# EAGLE design ChestStrapV3 (EAGLE 5.07)
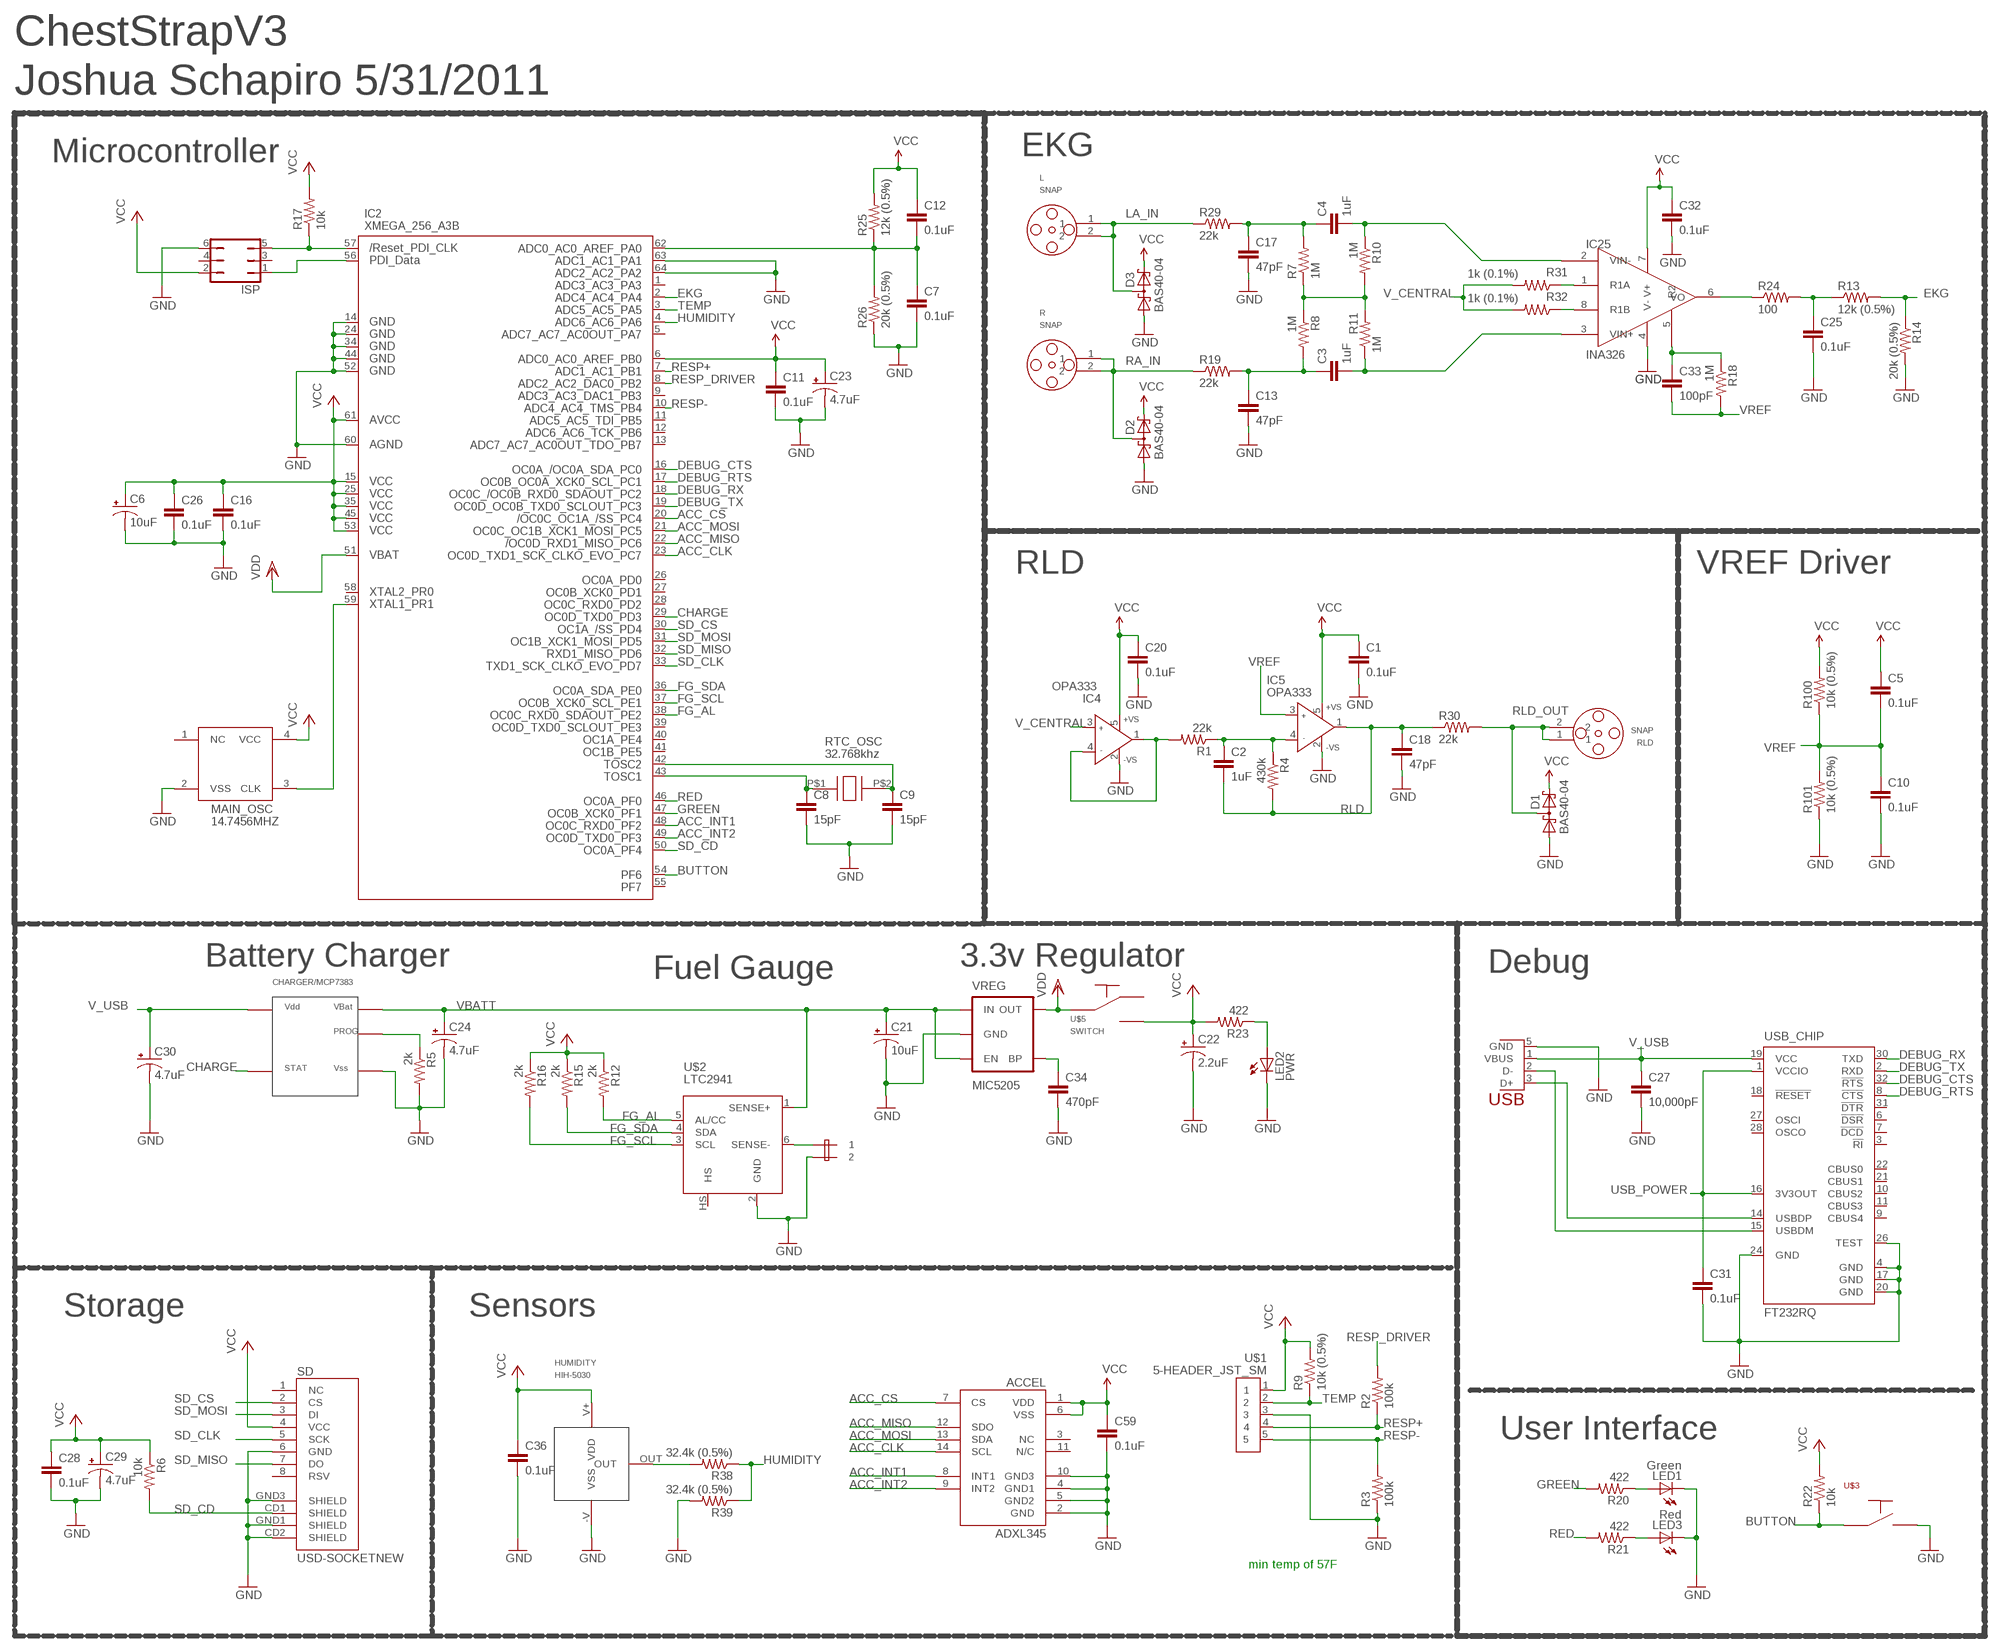
[diagram p0: schematic, sheet 1]

## Parts
ACCEL  ADXL345  [LGA14]
C1  0.1uF  CAP0805  [0805]
C2  1uF  CAP0805  [0805]
C3  1uF  CAP0805  [0805]
C4  1uF  CAP0805  [0805]
C5  0.1uF  CAP0805  [0805]
C6  10uF  CAP_POL1206  [EIA3216]
C7  0.1uF  CAP0805  [0805]
C8  15pF  CAP0805  [0805]
C9  15pF  CAP0805  [0805]
C10  0.1uF  CAP0805  [0805]
C11  0.1uF  CAP0805  [0805]
C12  0.1uF  CAP0805  [0805]
C13  47pF  CAP0805  [0805]
C16  0.1uF  CAP0805  [0805]
C17  47pF  CAP0805  [0805]
C18  47pF  CAP0805  [0805]
C20  0.1uF  CAP0805  [0805]
C21  10uF  CAP_POL1206  [EIA3216]
C22  2.2uF  CAP_POL1206  [EIA3216]
C23  4.7uF  CAP_POL1206  [EIA3216]
C24  4.7uF  CAP_POL1206  [EIA3216]
C25  0.1uF  CAP0805  [0805]
C26  0.1uF  CAP0805  [0805]
C27  10,000pF  CAP0805  [0805]
C28  0.1uF  CAP0805  [0805]
C29  4.7uF  CAP_POL1206  [EIA3216]
C30  4.7uF  CAP_POL1206  [EIA3216]
C31  0.1uF  CAP0805  [0805]
C32  0.1uF  CAP0805  [0805]
C33  100pF  CAP0805  [0805]
C34  470pF  CAP0805  [0805]
C36  0.1uF  CAP0805  [0805]
C59  0.1uF  CAP0805  [0805]
CHARGER/MCP7383  MCP73831  [SOT23-5]
D1  BAS40-04  [SOT23]
D2  BAS40-04  [SOT23]
D3  BAS40-04  [SOT23]
HUMIDITY  HIH-5030  [HIH-5030]
IC2  XMEGA_256_A3B  AVR_XMEGA_A3B_64M2  [MLF64]
IC4  OPA333  AD8067  [SOT23-5]
IC5  OPA333  AD8067  [SOT23-5]
IC25  INA326  [DGK_S-PDSO-G8]
ISP  JP3Q  [JP3Q]
L  SNAP  [SNAP]
LED1  Green  LEDCHIP-LED0805  [CHIP-LED0805]
LED2  PWR  LEDCHIP-LED0805  [CHIP-LED0805]
LED3  Red  LEDCHIP-LED0805  [CHIP-LED0805]
MAIN_OSC  14.7456MHZ  16MHZ-OSC  [4-SMD]
R  SNAP  [SNAP]
R1  22k  RESISTOR0805-RES  [0805]
R2  100k  RESISTOR0805-RES  [0805]
R3  100k  RESISTOR0805-RES  [0805]
R4  430k  RESISTOR0805-RES  [0805]
R5  2k  RESISTOR0805-RES  [0805]
R6  10k  RESISTOR0805-RES  [0805]
R7  1M  RESISTOR0805-RES  [0805]
R8  1M  RESISTOR0805-RES  [0805]
R9  10k (0.5%)  RESISTOR0805-RES  [0805]
R10  1M  RESISTOR0805-RES  [0805]
R11  1M  RESISTOR0805-RES  [0805]
R12  2k  RESISTOR0805-RES  [0805]
R13  12k (0.5%)  RESISTOR0805-RES  [0805]
R14  20k (0.5%)  RESISTOR0805-RES  [0805]
R15  2k  RESISTOR0805-RES  [0805]
R16  2k  RESISTOR0805-RES  [0805]
R17  10k  RESISTOR0805-RES  [0805]
R18  1M  RESISTOR0805-RES  [0805]
R19  22k  RESISTOR0805-RES  [0805]
R20  422  RESISTOR0805-RES  [0805]
R21  422  RESISTOR0805-RES  [0805]
R22  10k  RESISTOR0805-RES  [0805]
R23  422  RESISTOR0805-RES  [0805]
R24  100  RESISTOR0805-RES  [0805]
R25  12k (0.5%)  RESISTOR0805-RES  [0805]
R26  20k (0.5%)  RESISTOR0805-RES  [0805]
R29  22k  RESISTOR0805-RES  [0805]
R30  22k  RESISTOR0805-RES  [0805]
R31  1k (0.1%)  RESISTOR0805-RES  [0805]
R32  1k (0.1%)  RESISTOR0805-RES  [0805]
R38  32.4k (0.5%)  RESISTOR0805-RES  [0805]
R39  32.4k (0.5%)  RESISTOR0805-RES  [0805]
R100  10k (0.5%)  RESISTOR0805-RES  [0805]
R101  10k (0.5%)  RESISTOR0805-RES  [0805]
RLD  SNAP  [SNAP]
RTC_OSC  32.768khz  RTC_CRYSTAL  [2-SMD]
SD  USD-SOCKETNEW  [MICRO-SD-SOCKET-PP]
U$1  5-HEADER_JST_SM  [5-HEADER_JST_SM]
U$2  LTC2941  [6-LEAD_DFN]
U$3  BUTTON  [SMDBUTTON]
U$4  2_HEADER_W/SR  [2-HEADER_W/SR]
U$5  SWITCH  [RA_J7_SM_SWTICH]
U$6  MICROB_SM  [MICROB_USB_SM]
USB_CHIP  FT232RQ  [QFN32]
VREG  MIC5205  V_REG_LDOSMD  [SOT23-5]

## Nets
ACC_CLK: ACCEL.14(SCL) IC2.23(PC7)
ACC_CS: ACCEL.7(CS) IC2.20(PC4)
ACC_INT1: ACCEL.8(INT1) IC2.48(PF2)
ACC_INT2: ACCEL.9(INT2) IC2.49(PF3)
ACC_MISO: ACCEL.12(SDO) IC2.22(PC6)
ACC_MOSI: ACCEL.13(SDA) IC2.21(PC5)
BUTTON: IC2.54(PF6) R22.1 U$3.1
CHARGE: CHARGER/MCP7383.1 IC2.29(PD3)
D+: U$6.3(D+) USB_CHIP.14(USBDP)
D-: U$6.2(D-) USB_CHIP.15(USBDM)
DEBUG_CTS: IC2.16(PC0) USB_CHIP.32(!RTS)
DEBUG_RTS: IC2.17(PC1) USB_CHIP.8(!CTS)
DEBUG_RX: IC2.18(PC2) USB_CHIP.30(TXD)
DEBUG_TX: IC2.19(PC3) USB_CHIP.2(RXD)
EKG: IC2.2(PA4) R13.2 R14.1
FG_AL: IC2.38(PE2) R12.2 U$2.5(AL/CC)
FG_SCL: IC2.37(PE1) R16.2 U$2.3(SCL)
FG_SDA: IC2.36(PE0) R15.2 U$2.4(SDA)
GND: ACCEL.2(GND) ACCEL.4(GND1) ACCEL.5(GND2) ACCEL.10(GND3) C1.2 C6.C(-) C7.2 C8.2 C9.2 C10.2 C11.2 C13.2 C16.2 C17.2 C18.2 C20.2 C21.C(-) C22.C(-) C23.C(-) C24.C(-) C25.2 C26.2 C27.2 C28.2 C29.C(-) C30.C(-) C31.2 C32.2 C34.2 C36.2 C59.2 CHARGER/MCP7383.2 D1.1(A1) D2.1(A1) D3.1(A1) HUMIDITY.-V(VSS) IC2.14(GND1) IC2.24(GND2) IC2.34(GND3) IC2.44(GND4) IC2.52(GND5) IC2.60(AGND) IC2.63(PA1) IC2.64(PA2) IC4.2(-VS) IC5.2(-VS) IC25.4(V-) ISP.6 LED1.C LED2.C LED3.C MAIN_OSC.2(VSS) R3.1 R5.2 R14.2 R26.1 R39.2 R101.1 SD.6(GND) SD.CD2(SHIELD) SD.GND1(SHIELD) SD.GND3(SHIELD) U$1.3 U$2.2(GND) U$3.3 U$4.2 U$6.5(GND) USB_CHIP.4(GND) USB_CHIP.17(GND) USB_CHIP.20(GND) USB_CHIP.24(GND) USB_CHIP.26(TEST) VREG.2(GND)
GREEN: IC2.47(PF1) R20.2
HUMIDITY: IC2.4(PA6) R38.1 R39.1
LA: C4.2 IC25.2(VIN-) R10.1
LA_IN: D3.3(C1A2) L.1 L.2 R29.1
N$1: C25.1 R13.1 R24.2
N$2: IC25.6(VO) R24.1
N$3: C34.1 VREG.4(BP)
N$4: C9.1 IC2.42(TOSC2) RTC_OSC.P$2
N$5: LED3.A R21.1
N$6: IC2.57(RESET) ISP.5 R17.1
N$7: IC2.56(PDI_DATA) ISP.1
N$8: C8.1 IC2.43(TOSC1) RTC_OSC.P$1
N$9: IC2.59(PR1) MAIN_OSC.3(CLK)
N$10: LED1.A R20.1
N$11: C7.1 C12.2 IC2.62(PA0) R25.1 R26.2
N$14: C3.1 C13.1 R8.2 R19.2
N$15: U$2.6(SENSE-) U$4.1
N$16: CHARGER/MCP7383.5 R5.1
N$18: IC25.1(R1A) R31.1
N$23: LED2.A R23.1
N$26: R7.1 R8.1 R10.2 R11.2
N$28: IC4.1(OUT) IC4.4(IN-) R1.2
N$32: C4.1 C17.1 R7.2 R29.2
N$36: IC25.8(R1B) R32.1
N$37: C33.1 IC25.5(R2) R18.1
N$38: C2.1 IC5.4(IN-) R1.1 R4.1
N$58: HUMIDITY.OUT R38.2
RA: C3.2 IC25.3(VIN+) R11.1
RA_IN: D2.3(C1A2) R19.1 R.1 R.2
RED: IC2.46(PF0) R21.2
RESP+: IC2.7(PB1) R2.1 U$1.4
RESP-: IC2.10(PB4) R3.2 U$1.5
RESP_DRIVER: IC2.8(PB2) R2.2
RLD: C2.2 C18.1 IC5.1(OUT) R4.2 R30.1
RLD_OUT: D1.3(C1A2) R30.2 RLD.1 RLD.2
SD_CD: IC2.50(PF4) R6.2 SD.CD1(SHIELD)
SD_CLK: IC2.33(PD7) SD.5(SCK)
SD_CS: IC2.30(PD4) SD.2(CS)
SD_MISO: IC2.32(PD6) SD.7(DO)
SD_MOSI: IC2.31(PD5) SD.3(DI)
TEMP: IC2.3(PA5) R9.1 U$1.2
USB_POWER: C31.1 USB_CHIP.1(VCCIO) USB_CHIP.16(3V3OUT)
V_CENTRAL: IC4.3(IN+) R31.2 R32.2
V_USB: C27.1 C30.A(+) CHARGER/MCP7383.4 U$6.1(VBUS) USB_CHIP.19(VCC)
VBATT: C21.A(+) C24.A(+) CHARGER/MCP7383.3 U$2.1(SENSE+) VREG.1(IN) VREG.3(EN)
VCC: ACCEL.1(VDD) ACCEL.6(VSS) C1.1 C5.1 C6.A(+) C11.1 C12.1 C16.1 C20.1 C22.A(+) C23.A(+) C26.1 C28.1 C29.A(+) C32.1 C36.1 C59.1 D1.2(C2) D2.2(C2) D3.2(C2) HUMIDITY.V+(VDD) IC2.6(PB0) IC2.15(VCC1) IC2.25(VCC2) IC2.35(VCC3) IC2.45(VCC4) IC2.53(VCC5) IC2.61(AVCC) IC4.5(+VS) IC5.5(+VS) IC25.7(V+) ISP.2 MAIN_OSC.4(VCC) R6.1 R9.2 R12.1 R15.1 R16.1 R17.2 R22.2 R23.2 R25.2 R100.2 SD.4(VCC) U$1.1 U$5.3
VDD: IC2.51(VBAT) U$5.2 VREG.5(OUT)
VREF: C5.2 C10.1 C33.2 IC5.3(IN+) R18.2 R100.1 R101.2
Unconnected: ACCEL.3(NC) ACCEL.11(N/C) IC2.1(PA3) IC2.5(PA7) IC2.9(PB3) IC2.11(PB5) IC2.12(PB6) IC2.13(PB7) IC2.26(PD0) IC2.27(PD1) IC2.28(PD2) IC2.39(PE3) IC2.40(PE4) IC2.41(PE5) IC2.55(PF7) IC2.58(PR0) ISP.3 ISP.4 MAIN_OSC.1(NC) SD.1(NC) SD.8(RSV) U$2.HS U$5.1 USB_CHIP.3(!RI) USB_CHIP.6(!DSR) USB_CHIP.7(!DCD) USB_CHIP.9(CBUS4) USB_CHIP.10(CBUS2) USB_CHIP.11(CBUS3) USB_CHIP.18(!RESET) USB_CHIP.21(CBUS1) USB_CHIP.22(CBUS0) USB_CHIP.27(OSCI) USB_CHIP.28(OSCO) USB_CHIP.31(!DTR)

## Notes on the sheet
- ChestStrapV3
- Joshua Schapiro 5/31/2011
- Microcontroller | EKG
- RLD | VREF Driver
- Battery Charger | 3.3v Regulator | Debug
- Fuel Gauge
- Storage | Sensors
- User Interface
- min temp of 57F

## Library data of the parts
ACCEL = SparkFun:ADXL345
C1-C5 C7-C13 C16-C18 C20 C25-C28 C31-C34 C36 C59 = SparkFun:CAP: Capacitor Standard 0603 ceramic capacitor, and 0.1" leaded capacitor.
C6 C21-C24 C29 C30 = SparkFun:CAP_POL: Capacitor Polarized These are standard SMD and PTH capacitors. Normally 10uF, 47uF, and 100uF in electrolytic and tantalum varieties. Always verify the external diameter of the through hole cap, it varies with capacity, voltage, and manufacturer. The EIA devices should be standard.
CHARGER/MCP7383 = GadgetOne:MCP73831: monolithic usb lipo charger
D1-D3 = diode:BAS40-04: Silicon Schottky Diodes General-purpose diode for high-speed switching
HUMIDITY = Josh:HIH-5030
IC2 = xmega:AVR_XMEGA_A3B_: Device for Atmel AVR XMEGA A3B Series
IC4 IC5 = analog-devices:AD8067: High Gain Bandwidth, Precision Fast FET(TM) Op Amp Source: http://www.analog.com/UploadedFiles/Data_Sheets/346131962AD8067_a.pdf
IC25 = mpocius:INA326
ISP = jumper:JP3Q: JUMPER
L R RLD = Josh:SNAP
LED1-LED3 = led:LED: LED OSRAM: - CHIPLED LG R971, LG N971, LY N971, LG Q971, LY Q971, LO R971, LY R971 LH N974, LH R974 LS Q976, LO Q976, LY Q976 LO Q996 - Hyper CHIPLED LW Q18S LB Q993, LB Q99A, LB R99A - SideLED LS A670, LO A670, LY A670, LG A670, LP A670 LB A673, LV A673, LT A673, LW A673 LH A674 LY A675 LS A676, LA A676, LO A676, LY A676, LW A676 LS A679, LY A679, LG A679 - Hyper Micro SIDELED® LS Y876, LA Y876, LO Y876, LY Y876 LT Y87S - SmartLED LW L88C, LW L88S LB L89C, LB L89S, LG L890 LS L89K, LO L89K, LY L89K LS L896, LA L896, LO L896, LY L896 - TOPLED LS T670, LO T670, LY T670, LG T670, LP T670 LSG T670, LSP T670, LSY T670, LOP T670, LYG T670 LG T671, LOG T671, LSG T671 LB T673, LV T673, LT T673, LW T673 LH T674 LS T676, LA T676, LO T676, LY T676, LB T676, LH T676, LSB T676, LW T676 LB T67C, LV T67C, LT T67C, LS T67K, LO T67K, LY T67K, LW E67C LS E67B, LA E67B, LO E67B, LY E67B, LB E67C, LV E67C, LT E67C LW T67C LS T679, LY T679, LG T679 LS T770, LO T770, LY T770, LG T770, LP T770 LB T773, LV T773, LT T773, LW T773 LH T774 LS E675, LA E675, LY E675, LS T675 LS T776, LA T776, LO T776, LY T776, LB T776 LHGB T686 LT T68C, LB T68C - Hyper Mini TOPLED® LB M676 - Mini TOPLED Santana® LG M470 LS M47K, LO M47K, LY M47K Source: http://www.osram.convergy.de - LUMILED® LXK2-PW12-R00, LXK2-PW12-S00, LXK2-PW14-U00, LXK2-PW14-V00 LXK2-PM12-R00, LXK2-PM12-S00, LXK2-PM14-U00 LXK2-PE12-Q00, LXK2-PE12-R00, LXK2-PE12-S00, LXK2-PE14-T00, LXK2-PE14-U00 LXK2-PB12-K00, LXK2-PB12-L00, LXK2-PB12-M00, LXK2-PB14-N00, LXK2-PB14-P00, LXK2-PB14-Q00 LXK2-PR12-L00, LXK2-PR12-M00, LXK2-PR14-Q00, LXK2-PR14-R00 LXK2-PD12-Q00, LXK2-PD12-R00, LXK2-PD12-S00 LXK2-PH12-R00, LXK2-PH12-S00 LXK2-PL12-P00, LXK2-PL12-Q00, LXK2-PL12-R00 Source: www.luxeon.com
MAIN_OSC = Josh:16MHZ-OSC
R1-R26 R29-R32 R38 R39 R100 R101 = SparkFun:RESISTOR: Resistor Basic schematic elements and footprints for 0603, 1206, and PTH resistors.
RTC_OSC = Josh:RTC_CRYSTAL
SD = SparkFun:USD-SOCKET: microSD Socket Push-push type uSD socket. Schematic element and footprint production proven. Spark Fun Electronics SKU : PRT-00127. tDoc lines correctly indicate media card edge positions when inserting (unlocked, locked, depressed).
U$1 = Josh:5-HEADER_JST_SM
U$2 = Josh:LTC2941
U$3 = GadgetOne:BUTTON
U$4 = Josh:2_HEADER_W/SR
U$5 = GadgetOne:SWITCH: Part number JS102011SAQN
U$6 = Josh:MICROB_SM
USB_CHIP = ftdichip:FT232R: Source: http://www.ftdichip.com/Documents/DataSheets/DS_FT232R_v104.pdf
VREG = SparkFun:V_REG_LDO: Voltage Regulator LDO Standard 150mA LDO voltage regulator in SOT-23 layout. Micrel part MIC5205. BP (by-pass) pin is used to lower output noise with 470pF cap.

## Board
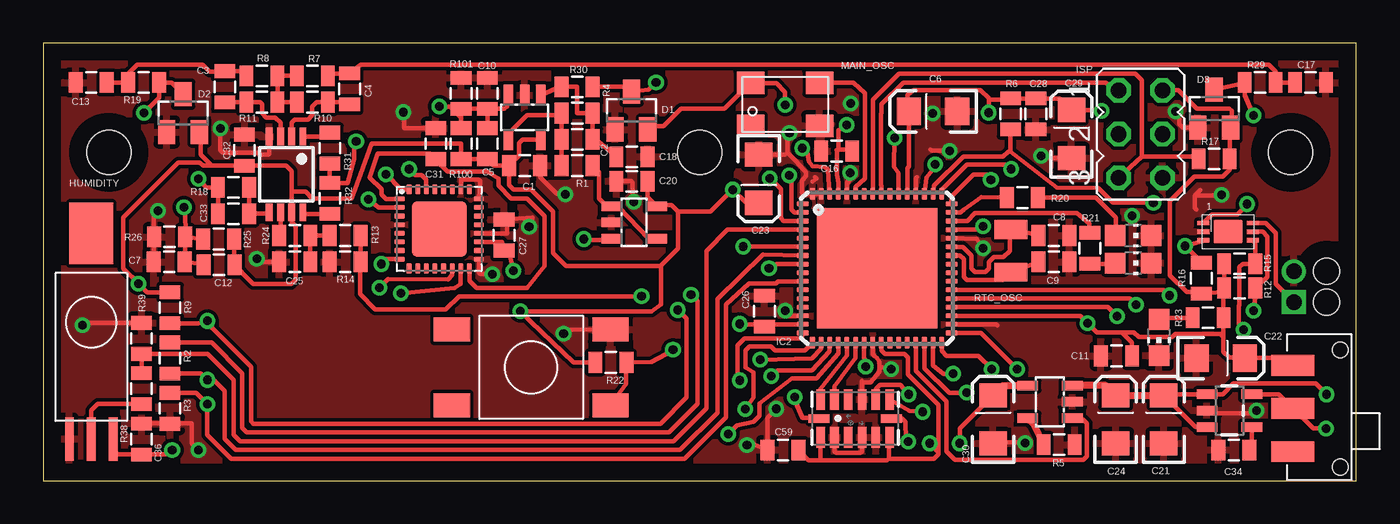
[diagram p1: board, top side]
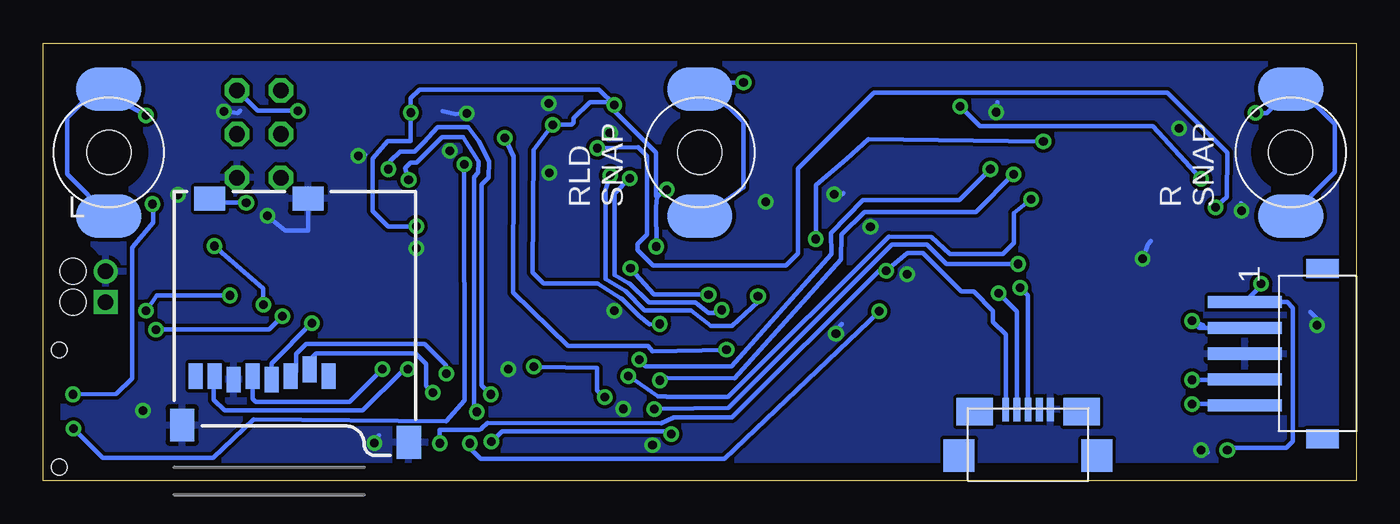
[diagram p2: board, bottom side, seen from below]

Size 76.2 x 25.4 mm. Coordinates in mm from the lower left corner, seen from the top.
Outline: 0,0 76.2,0 76.2,25.4 0,25.4 0,0
Copper layers (1*16): Top 0.035mm / dielectric 1.5mm / Bottom 0.035mm
Design rules "default *": minimum track width 10mil, minimum drill 10mil, track to track 8mil, track to pad 5mil, pad to pad 5mil, via to via 8mil, smd to smd 8mil, copper to edge 40mil, drill to drill 8mil, minimum pad ring 10mil, minimum via ring 8mil, stop-mask expansion 4mil, vias tented up to drill 0mil, thermal gap 10mil

### Footprints (pad centres in the part's own frame; a part is rotated, then mirrored left to right if it is on the bottom)
LGA14 = smd 0.5 x 1.2: 1 2,1.1; 2 1.2,1.1; 3 0.4,1.1; 4 -0.4,1.1; 5 -1.2,1.1; 6 -2,1.1; 8 -2,-1.1; 9 -1.2,-1.1; 10 -0.4,-1.1; 11 0.4,-1.1; 12 1.2,-1.1; 13 2,-1.1 | smd 1.2 x 0.5: 7 -2.1,0; 14 2.1,0
0805 = smd 0.8 x 1.2: 1 -0.9,0; 2 0.9,0
EIA3216 = smd 1.4 x 1.6: A 1.4,0; C -1.4,0
SOT23-5 = smd 0.55 x 1.2: 1 -0.95,-1.3; 2 0,-1.3; 3 0.95,-1.3; 4 0.95,1.3; 5 -0.95,1.3
SOT23 = smd 1 x 1.4: 1 -0.95,-1.1; 2 0.95,-1.1; 3 0,1.1
HIH-5030 = smd 0.508 x 2.54: -V -1.27,-5.334; OUT 0,-5.334; V+ 1.27,-5.334 | smd 2.54 x 3.556: NC 0,6.604
MLF64 = smd 0.7 x 0.3: 1 -4.325,3.75; 2 -4.325,3.25; 3 -4.325,2.75; 4 -4.325,2.25; 5 -4.325,1.75; 6 -4.325,1.25; 7 -4.325,0.75; 8 -4.325,0.25; 9 -4.325,-0.25; 10 -4.325,-0.75; 11 -4.325,-1.25; 12 -4.325,-1.75; 13 -4.325,-2.25; 14 -4.325,-2.75; 15 -4.325,-3.25; 16 -4.325,-3.75; 33 4.325,-3.75; 34 4.325,-3.25; 35 4.325,-2.75; 36 4.325,-2.25; 37 4.325,-1.75; 38 4.325,-1.25; 39 4.325,-0.75; 40 4.325,-0.25; 41 4.325,0.25; 42 4.325,0.75; 43 4.325,1.25; 44 4.325,1.75; 45 4.325,2.25; 46 4.325,2.75; 47 4.325,3.25; 48 4.325,3.75 | smd 0.3 x 0.7: 17 -3.75,-4.325; 18 -3.25,-4.325; 19 -2.75,-4.325; 20 -2.25,-4.325; 21 -1.75,-4.325; 22 -1.25,-4.325; 23 -0.75,-4.325; 24 -0.25,-4.325; 25 0.25,-4.325; 26 0.75,-4.325; 27 1.25,-4.325; 28 1.75,-4.325; 29 2.25,-4.325; 30 2.75,-4.325; 31 3.25,-4.325; 32 3.75,-4.325; 49 3.75,4.325; 50 3.25,4.325; 51 2.75,4.325; 52 2.25,4.325; 53 1.75,4.325; 54 1.25,4.325; 55 0.75,4.325; 56 0.25,4.325; 57 -0.25,4.325; 58 -0.75,4.325; 59 -1.25,4.325; 60 -1.75,4.325; 61 -2.25,4.325; 62 -2.75,4.325; 63 -3.25,4.325; 64 -3.75,4.325 | smd 7 x 7: TH 0,0
DGK_S-PDSO-G8 = smd 0.4 x 1: 1 -0.975,-2.2; 2 -0.325,-2.2; 3 0.325,-2.2; 4 0.975,-2.2; 5 0.975,2.2; 6 0.325,2.2; 7 -0.325,2.2; 8 -0.975,2.2
JP3Q = drill 0.914 octagon: 1 -2.54,-1.27; 2 -2.54,1.27; 3 0,-1.27; 4 0,1.27; 5 2.54,-1.27; 6 2.54,1.27
SNAP = smd 2.54 x 3.81: 1 -3.683,0; 2 3.683,0 | hole 2.54: 0,0
CHIP-LED0805 = smd 1.2 x 1.2: A 0,-1.05; C 0,1.05
4-SMD = smd 1.6 x 1.3: 1 -2,-1.25; 2 2,-1.25; 3 2,1.25; 4 -2,1.25
2-SMD = smd 1.092 x 1.905: P$1 -1.245,0; P$2 1.245,0
MICRO-SD-SOCKET-PP = smd 0.8 x 1.5: 1 -8.94,10.7; 2 -7.84,10.3; 3 -6.74,10.7; 4 -5.64,10.9; 5 -4.54,10.7; 6 -3.44,10.9; 7 -2.34,10.7; 8 -1.24,10.7 | smd 1.8 x 1.4: CD1 -2.05,0.4; CD2 -7.75,0.4 | smd 1.4 x 1.9: GND1 -13.6,14.55; GND3 -0.45,13.55
5-HEADER_JST_SM = smd 0.7 x 4.3: 1 -3,-2.15; 2 -1.5,-2.15; 3 0,-2.15; 4 1.5,-2.15; 5 3,-2.15 | smd 1.1 x 1.9: P$6 4.95,2.35; P$7 -4.95,2.35
6-LEAD_DFN = smd 0.7 x 0.25: 1 -1.425,0.5; 2 -1.425,0; 3 -1.425,-0.5; 4 1.425,-0.5; 5 1.425,0; 6 1.425,0.5 | smd 1.65 x 1.35: HS 0,0
SMDBUTTON = smd 2.1 x 1.4: 1 -1.6,5.2; 2 7.6,5.2; 3 -1.6,0.8; 4 7.6,0.8
2-HEADER_W/SR = drill 0.9 square: 1 0,-0.889 | drill 0.9 round: 2 0,0.889 | hole 1.5: 1.905,0.889; 1.905,-0.889
RA_J7_SM_SWTICH = smd 1.2 x 2.5: 1 -2.5,0; 2 0,0; 3 2.5,0 | hole 0.9: 3.4,-2.75; -3.4,-2.75
MICROB_USB_SM = smd 0.4 x 1.35: 1 -1.3,4.125; 2 -0.65,4.125; 3 0,4.125; 4 0.65,4.125; 5 1.3,4.125 | smd 1.8 x 1.9: P$1 -4,1.45; P$2 4,1.45 | smd 2.1 x 1.6: P$3 -3.1,4; P$4 3.1,4
QFN32 = smd 0.6 x 0.3: 1 -2.3,1.75; 2 -2.3,1.25; 3 -2.3,0.75; 4 -2.3,0.25; 5 -2.3,-0.25; 6 -2.3,-0.75; 7 -2.3,-1.25; 8 -2.3,-1.75; 17 2.3,-1.75; 18 2.3,-1.25; 19 2.3,-0.75; 20 2.3,-0.25; 21 2.3,0.25; 22 2.3,0.75; 23 2.3,1.25; 24 2.3,1.75 | smd 0.3 x 0.6: 9 -1.75,-2.3; 10 -1.25,-2.3; 11 -0.75,-2.3; 12 -0.25,-2.3; 13 0.25,-2.3; 14 0.75,-2.3; 15 1.25,-2.3; 16 1.75,-2.3; 25 1.75,2.3; 26 1.25,2.3; 27 0.75,2.3; 28 0.25,2.3; 29 -0.25,2.3; 30 -0.75,2.3; 31 -1.25,2.3; 32 -1.75,2.3 | smd 3.2 x 3.2: EXP 0,0

### Placement (x,y rotation side)
ACCEL  47.12,3.61 180 top
C1  27.94,18.29 0 top
C2  30.99,19.81 0 top
C3  10.54,22.86 270 top
C4  17.78,22.73 270 top
C5  25.78,19.56 90 top
C6  51.64,21.44 180 top
C7  7.32,12.7 180 top
C8  58.65,14.22 0 top
C9  58.65,12.7 0 top
C10  25.78,22.48 90 top
C11  62.28,7.24 180 top
C12  10.21,12.52 180 top
C13  2.79,23.11 180 top
C16  46.05,19.13 180 top
C17  73.53,23.11 0 top
C18  34.16,18.8 0 top
C20  34.16,17.37 180 top
C21  65.02,3.56 90 top
C22  68.33,7.11 0 top
C23  41.53,17.53 270 top
C24  62.23,3.56 90 top
C25  14.61,12.7 180 top
C26  41.86,9.83 90 top
C27  26.75,14.25 90 top
C28  57.61,21.29 270 top
C29  59.66,20.12 90 top
C30  55.12,3.56 90 top
C31  22.78,19.56 90 top
C32  11.68,19.18 90 top
C33  11.05,15.49 180 top
C34  69.09,1.78 180 top
C36  5.71,2.41 90 top
C59  42.93,1.78 180 top
CHARGER/MCP7383  58.42,4.57 90 top
D1  34.14,21.49 0 top
D2  8.13,21.34 0 top
D3  67.94,21.59 0 top
HUMIDITY  2.79,7.75 0 top
IC2  48.39,12.32 0 top
IC4  34.29,14.99 270 top
IC5  27.94,21.08 180 top
IC25  14.1,17.78 180 top
ISP  63.68,20.12 270 top
L  72.39,19.05 90 bottom
LED1  63.25,14.22 270 top
LED2  64.74,8.31 180 top
LED3  63.25,12.62 270 top
MAIN_OSC  43.05,21.84 0 top
R  3.81,19.05 90 bottom
R1  30.99,18.29 0 top
R2  7.37,7.11 90 top
R3  7.37,4.19 90 top
R4  30.99,21.34 0 top
R5  58.95,2.08 0 top
R6  56.13,21.29 270 top
R7  15.62,23.5 0 top
R8  12.7,23.5 180 top
R9  7.37,10.03 90 top
R10  15.62,21.97 180 top
R11  12.7,21.97 0 top
R12  69.43,11.18 0 top
R13  17.53,14.22 0 top
R14  17.53,12.7 180 top
R15  69.43,12.58 0 top
R16  67.2,11.74 90 top
R17  67.94,18.67 0 top
R18  11.05,17.02 180 top
R19  5.84,23.11 180 top
R20  56.82,16.43 180 top
R21  60.73,13.49 90 top
R22  32.94,6.86 180 top
R23  67.59,9.45 0 top
R24  14.61,14.22 0 top
R25  10.19,14.02 0 top
R26  7.34,14.15 0 top
R29  70.61,23.11 0 top
R30  30.99,22.86 0 top
R31  16.64,19.3 270 top
R32  16.64,16.38 90 top
R38  5.71,5.33 270 top
R39  5.71,8.26 90 top
R100  24.26,19.56 270 top
R101  24.26,22.48 270 top
RLD  38.1,19.05 90 bottom
RTC_OSC  56.16,13.34 270 top
SD  68.58,16.76 180 bottom
U$1  4.32,7.37 270 bottom
U$2  68.75,14.45 0 top
U$3  31.32,9.58 180 top
U$4  72.57,11.25 0 top
U$5  72.52,4.19 90 top
U$6  19.05,0 0 bottom
USB_CHIP  22.99,14.61 0 top
VREG  68.83,4.06 270 top

### Tracks (layer width: path | path; a pad name or v marks a point on that pad's centre or on a via)
ACC_CLK  (via drill 0.5)
  Top 0.254: IC2.23 47.64,7.2 v47.73,6.6 | v43.61,4.85 43.61,4.62 44.07,3.63 44.99,3.63 ACCEL.14
  Bottom 0.254: v47.73,6.6 44.07,6.55 44.07,5.23 v43.61,4.85
ACC_CS  (via drill 0.5)
  Top 0.254: IC2.20 46.14,7.38 44.88,5.94 43.46,5.94 41.58,4.47 41.58,3.76 41.22,3.4 40.26,3.2 v39.75,2.69 | ACCEL.7 49.84,3.61 50.04,3.4 50.06,2.39 v50.19,2.26
  Bottom 0.254: 49.86,2.56 50.16,2.26 v50.19,2.26 49.55,2.87 39.95,2.87 v39.75,2.69
ACC_INT1  (via drill 0.5)
  Top 0.254: IC2.48 52.71,16.49 53.98,17.75 55.07,17.75 v54.99,17.45 | v51.03,3.99 50.27,4.04 ACCEL.8
  Bottom 0.254: v54.99,17.45 55.19,18.14 54.86,18.47 54.53,18.47 53.03,19.94 51.84,19.94 50.93,18.52 50.95,17.88 51.21,17.63 51.21,4.17 v51.03,3.99
ACC_INT2  (via drill 0.5)
  Top 0.254: ACCEL.9 48.32,5.32 48.56,5.56 49.73,5.56 v50.22,5 | IC2.49 52.14,16.88 53.59,18.34 55.96,18.34 v56.16,18.09
  Bottom 0.254: v50.22,5 50.75,5.54 50.75,17.2 50.34,17.6 50.32,18.52 50.9,19.68 51.54,20.52 53.31,20.52 54.13,19.61 54.63,19.1 55.5,19.1 56.06,18.54 v56.16,18.09
ACC_MISO
  Top 0.254: IC2.22 47.14,7.13 45.92,5.46 ACCEL.12
ACC_MOSI
  Top 0.254: ACCEL.13 45.12,5.32 46.64,7.27 IC2.21
BUTTON  (via drill 0.5)
  Top 0.254: U$3.1 33.83,5.63 R22.1 35.31,6.88 36.55,7.54 36.58,7.54 v36.55,7.59 | IC2.54 49.64,16.86 49.63,16.87 49.63,17.86 49.38,18.24 v49.4,19.89
  Bottom 0.254: v49.4,19.89 48.9,18.82 48.92,10.92 45.74,7.82 41.1,7.82 40.84,7.49 v36.55,7.59
CHARGE
  Top 0.254: IC2.29 50.64,6.36 52.4,4.6 52.4,1.7 52.91,1.19 60.35,1.19 60.55,1.4 60.55,3.33 60.33,3.56 59.79,3.56 CHARGER/MCP7383.1
D+  (via drill 0.5)
  Top 0.254: USB_CHIP.14 23.74,11.93 23.5,11.68 20.02,11.71 v19.51,11.2
  Bottom 0.254: 19.18,11.2 v19.51,11.2 19.05,10.74 U$6.3
D-  (via drill 0.5)
  Top 0.254: USB_CHIP.15 24.24,11.41 23.88,11.18 v20.75,10.87
  Bottom 0.254: U$6.2 19.7,9.82 v20.75,10.87
DEBUG_CTS  (via drill 0.5)
  Top 0.254: USB_CHIP.32 20.76,16.91 v19.89,17.78 | v40.41,5.82 40.28,5.84 40.28,7.85 40.69,8.26 43.89,8.26 44.06,8.43 IC2.16
  Bottom 0.254: v19.89,17.78 22.07,15.6 28.55,15.6 29.87,14.28 29.92,12.83 36.09,5.94 40.01,5.97 40.21,5.77 v40.41,5.82
DEBUG_RTS  (via drill 0.5)
  Top 0.254: USB_CHIP.8 19.92,12.86 v19.63,12.57 | v40.74,4.14 41.22,4.83 41.22,6.27 40.74,6.58 40.74,7.57 41,7.8 42.24,7.8 42.47,7.57 44.21,7.57 IC2.17
  Bottom 0.254: v19.63,12.57 23.8,12.57 24.92,13.69 26.95,13.69 36.42,4.22 40.44,4.17 v40.74,4.14
DEBUG_RX  (via drill 0.5)
  Top 0.254: USB_CHIP.30 22.24,17.46 21.97,17.73 21.59,17.73 v21.23,18.09 | v41.6,7.01 44.6,7.09 45.14,7.65 IC2.18
  Bottom 0.254: v21.23,18.09 23.04,16.28 28.63,16.28 30.48,14.38 30.45,13.16 36.27,6.63 41.25,6.63 v41.6,7.01
DEBUG_TX  (via drill 0.5)
  Top 0.254: USB_CHIP.2 19.48,15.86 v18.87,16.33 | v42.24,6.07 42.62,6.4 44.6,6.4 45.64,7.51 IC2.19
  Bottom 0.254: v18.87,16.33 19.86,15.52 19.86,13.79 20.5,13.16 23.6,13.16 24.66,14.15 27.13,14.17 36.45,4.85 40.03,4.85 40.06,4.88 40.51,4.9 v42.24,6.07
EKG  (via drill 0.5)
  Top 0.254: R13.2 R14.1 18.39,12.66 18.39,10.82 19.28,9.93 23.37,9.93 24.13,10.69 v34.72,10.69 | v43.28,17.73 43.43,17.42 43.43,15.72 43.59,15.57 IC2.2
  Bottom 0.254: v34.72,10.69 34.72,10.36 36.22,8.99 37.44,8.99 38.61,9.88 41.3,9.88 42.42,11 43.56,11.71 43.56,16.89 v43.28,17.73
FG_AL  (via drill 0.5)
  Top 0.254: U$2.5 70.77,14.45 71.04,14.17 71.04,11.82 R12.2 70.38,10.99 v70.23,9.86 | IC2.38 65.03,11.07 v65.35,10.74
  Bottom 0.254: v65.35,10.74 69.62,10.74 v70.23,9.86
FG_SCL  (via drill 0.5)
  Top 0.254: IC2.37 63.07,10.57 v63.42,10.21 | U$2.3 67.37,13.95 v66.27,13.61 67.2,12.68 R16.2
  Bottom 0.254: v63.42,10.21 63.42,11.15 v66.27,13.61
FG_SDA  (via drill 0.5)
  Top 0.254: U$2.4 70.33,13.8 R15.2 69.61,12.58 69.42,12.39 69.42,10.19 69.37,10.13 69.37,9.09 69.65,8.81 v69.65,8.76 | 62.08,9.8 62.31,9.58 v62.31,9.55 61.79,10.07 IC2.36
  Bottom 0.254: v69.65,8.76 63.09,8.76 v62.31,9.55
GND  (via drill 0.5)
  Top 0.254: USB_CHIP.26 24.26,16.93 24.26,17.48 25.27,17.48 25.36,17.41 USB_CHIP.24 | D3.1 66.12,20.49 65.91,20.7 65.91,20.95 v65.71,21.44 | 66.9,15.75 66.83,15.82 66.83,16.56 | 66.83,16.56 67.13,16.87 | C36.2 7.34,3.31 | 7.34,3.31 R3.1 | 7.34,3.31 8.62,3.31 8.64,3.3 8.64,2.16 v9.02,1.78 | R39.2 2.42,9.15 v2.29,9.02 | IC25.4 13.12,18.96 13.08,18.92 12.57,18.92 12.45,19.05 10.41,19.05 10.29,19.18 v10.29,20.45 | v28.19,14.73 28.41,15.28 C27.2 26.92,15.2 26.92,14.35 26.92,14.36 USB_CHIP.20 | C31.2 20.97,20.46 20.95,20.45 v20.9,21.39 | C1.2 28.84,17.62 29.79,16.66 30.25,16.66 v30.3,16.61 | 66.83,16.56 68.35,16.56 v68.38,16.59 | USB_CHIP.17 25.29,12.05 25.35,11.99 v26.06,11.99 | IC2.34 55.32,9.07 55.37,9.02 | IC2.44 54.18,14.02 v54.53,13.49 | v63.2,15.37 63.12,15.04 63.07,15.01 | C29.C 57.99,18.72 v57.91,18.85 | ACCEL.2 45.92,1.66 46,1.63 47.4,1.63 47.5,1.68 47.5,2.49 ACCEL.4 | 47.52,5.69 48.01,5.69 48.51,6.3 48.51,6.6 | 47.52,5.69 47.5,5.79 | 47.52,5.69 ACCEL.10 | IC2.24 48.14,7.34 48.26,7.21 48.39,7.11 48.51,6.88 48.51,6.6 | v40.84,2.06 41.07,2.16 C59.2 42.03,3.65 v42.55,4.17 | 48.51,6.6 v49.2,6.48 | IC2.14 43.31,9.57 v43.05,9.86 | C20.2 34.14,17.37 34.21,17.3 34.21,16.2 v34.27,16.18 | C18.2 35.06,19.14 35.13,19.2 | C23.C 43.06,18.93 43.18,19.05 | 43.18,19.05 43.18,20.07 v43.31,20.19 | IC2.60 46.64,17.3 | 46.64,17.3 47.09,17.73 | v46.86,21.89 47.09,21.67 | 46.64,17.3 46.73,17.3 46.74,17.3 46.74,17.6 v46.84,17.86 | C30.C 55.04,2.16 SD.GND1 56.94,2.21 v56.97,2.18 | VREG.2 67.69,3.91 70.23,3.91 v70.41,4.06 | U$3.3 30.44,8.75 v30.2,8.53 | 44.78,17.63 44.88,17.52 44.63,17.35 | IC2.64 44.63,16.66 | C25.2 12.29,12.7 v12.39,12.88
  Top 0.254: C7.2 6.42,15.43 v6.66,15.67 | v52.6,19.15 51.56,19.15 51.49,19.23 | IC2.52 50.64,17.57 50.7,17.63 | IC2.64 | IC2.64 44.65,16.64 | IC2.63 44.09,16.64 44.02,16.71 44.02,17.42 44.27,17.68 44.27,17.91 43.79,18.39 43.79,18.44 43.18,19.05
  Bottom 0.254: v65.71,21.44 64.9,21.34 64.77,21.46 | v9.02,1.78 8.76,1.78 8.64,1.65 | v2.29,9.02 2.29,9.4 2.67,9.78 | v10.29,20.45 10.29,20.57 10.16,20.7 | v28.19,14.73 28.07,14.86 28.19,14.99 | v20.9,21.39 20.83,21.97 | v30.3,16.61 29.84,16.61 29.77,16.69 | v68.38,16.59 68.25,16.59 68.15,16.69 | v26.06,11.99 26.06,12.09 26.26,12.29 | v54.53,13.49 54.51,13.72 54.3,13.51 | SD.CD2 60.83,14.53 60.81,14.5 62.15,14.5 v63.2,15.37 | v57.91,18.85 57.56,18.87 57.51,18.92 | v40.84,2.06 40.87,2.06 40.72,1.91 | v49.2,6.48 49.38,6.38 49.33,6.38 | v43.05,9.86 42.98,9.88 | v51.61,21.31 52.27,21.29 53.01,21.44 | v34.27,16.18 34.24,16.1 34.29,16.05 | v43.31,20.19 43.43,20.19 43.56,20.32 | v46.86,21.89 46.86,22.1 | v52.6,19.15 52.88,19.36 | v46.84,17.86 46.91,17.98 46.76,18.14 | v56.97,2.18 56.97,2.34 56.69,2.62 | v70.41,4.06 70.43,4.01 70.31,3.89 | v30.2,8.53 30.25,8.69 29.84,9.09 | v42.55,4.17 42.29,4.17 42.27,4.14 | v12.39,12.88 12.12,13.72 11.94,13.89 | v6.66,15.67 6.66,16.05 6.71,16.1
  pour Top: 0,0 76.2,0 76.2,25.4 0,25.4
  pour Bottom: 0,0 76.2,0 76.2,25.4 0,25.4
GREEN
  Top 0.254: IC2.47 53.24,15.57 53.42,15.75 54.43,16.46 R20.2
HUMIDITY
  Top 0.254: R38.1 R39.1 9.54,7.36 11.05,5.84 11.05,2.67 11.43,2.29 36.58,2.29 38.48,4.19 38.48,13.34 39.72,14.57 IC2.4
LA
  Top 0.254: C4.2 17.64,21.97 R10.1 15.88,21.97 15.62,21.72 15.62,21.21 15.37,20.95 14.61,20.95 14.42,20.77 IC25.2
LA_IN  (via drill 0.5)
  Top 0.254: D3.3 69.26,22.99 R29.1 69.71,22.36 v70.23,21.21
  Bottom 0.254: L.1 74.8,17.78 74.8,21.08 73.15,22.73 L.2 71.63,21.97 v70.23,21.21
N$1
  Top 0.254: C25.1 R24.2 R13.1
N$2
  Top 0.254: IC25.6 13.77,14.29 R24.1
N$3
  Top 0.254: VREG.4 70.13,1.92 C34.1
N$4
  Top 0.254: C9.1 56.15,12.09 RTC_OSC.P$2 55.7,11.63 53.59,11.63 53.42,11.81 53.42,12.85 53.2,13.07 IC2.42
N$5
  Top 0.254: R21.1 62.16,12.59 LED3.A
N$6
  Top 0.254: IC2.57 48.14,22.1 49.66,23.62 63.37,23.62 63.75,23.24 63.75,18.8 | 63.75,18.8 ISP.5 | 63.75,18.8 66.92,18.8 R17.1
N$7
  Top 0.254: ISP.1 62.18,22.66 61.67,23.11 49.91,23.11 48.64,21.84 48.64,21.34 | 48.64,21.34 48.64,21.84 | IC2.56 48.64,17.12 48.62,17.14 48.62,21.31 48.64,21.34
N$8
  Top 0.254: 56.69,14.2 56.26,14.63 RTC_OSC.P$1 | RTC_OSC.P$1 56.4,14.58 C8.1 | IC2.43 53.36,13.57 53.87,13.06 53.87,12.32 54.08,12.12 54.69,12.12 54.89,12.32 54.89,12.7 55.17,12.98 55.73,12.98 56.08,13.34 56.08,14.5 RTC_OSC.P$1
N$9
  Top 0.254: MAIN_OSC.3 47.01,23.09 47.68,22.48 47.68,17.53 47.14,17.04 IC2.59
N$10
  Top 0.254: R20.1 61.09,16.43 62.26,15.27 62.26,14.41 LED1.A
N$11  (via drill 0.5)
  Top 0.254: R26.2 R25.1 | R26.2 8.24,12.72 C7.1 9.26,12.57 C12.2 | IC2.62 45.53,18.07 45.36,18.21 44.63,18.26 44.42,18.52 44.35,19 v44.04,19.3 | v8.18,15.88 8.08,15.85 8.26,15.67 8.28,14.19 R26.2
  Bottom 0.254: v44.04,19.3 41.68,19.36 41.17,18.85 41.17,14.28 41.71,13.74 41.71,13.39 40.82,12.5 33.1,12.5 32.41,13.18 32.41,18.11 27.99,22.53 10.97,22.53 7.49,19.05 7.52,16.46 v8.18,15.88
N$14
  Top 0.254: C13.1 R19.2 4.94,23.61 5.46,24.13 9.27,24.13 9.65,23.75 10.55,23.75 | 10.55,23.75 11.05,23.75 | 10.55,23.75 C3.1 11.54,23.76 R8.2
N$15
  Top 0.254: U$2.6 70.95,14.95 71.53,14.38 71.53,11.4 U$4.1
N$16
  Top 0.406: R5.1 57.52,3.22 CHARGER/MCP7383.5
N$18
  Top 0.254: IC25.1 16.41,19.98 R31.1
N$23
  Top 0.254: R23.1 64.84,9.45 LED2.A
N$26
  Top 0.254: R7.1 R8.1 R11.2 R10.2
N$28
  Top 0.254: R1.2 32.26,17.92 32.26,16.38 32.7,15.94 IC4.1 33.05,15.88 33.38,15.88 35.16,14.04 IC4.4
N$32
  Top 0.254: C17.1 R29.2 71.51,23.74 71.12,24.13 18.43,24.13 C4.1 16.66,23.63 R7.2
N$36
  Top 0.254: R32.1 15.17,15.48 IC25.8
N$37
  Top 0.254: R18.1 C33.1 13.04,15.49 IC25.5
N$38
  Top 0.254: IC5.4 27.15,20.29 28.07,21.21 29.96,21.21 arc90 R4.1 C2.1 R1.1
N$58
  Top 0.254: HUMIDITY.OUT 2.79,4.06 3.17,4.45 5.7,4.45 R38.2
RA
  Top 0.254: 11.79,21.96 C3.2 | R11.1 11.79,21.96 | 11.79,21.96 12.58,21.96 12.7,21.84 12.7,21.34 12.95,21.08 13.46,21.08 13.77,20.77 IC25.3
RA_IN  (via drill 0.5)
  Top 0.254: D2.3 7.45,23.11 R19.1 6.74,22.24 v5.84,21.34
  Bottom 0.254: v5.84,21.34 5.21,21.34 R.2 3.3,22.73 1.27,20.7 1.27,17.91 R.1
RED
  Top 0.254: R21.2 60.71,14.94 59.97,15.54 54.08,15.54 53.63,15.07 IC2.46
RESP+  (via drill 0.5)
  Top 0.254: R2.1 9.15,6.21 v9.53,5.84 9.91,5.84 10.54,5.21 10.54,2.41 11.18,1.78 36.96,1.78 39.12,3.94 39.12,10.54 41.77,13.12 IC2.7
  Bottom 0.254: v9.53,5.84 6.49,5.84 U$1.4
RESP-  (via drill 0.5)
  Top 0.254: R3.2 8.88,5.09 v9.53,4.45 9.53,2.67 10.92,1.27 37.21,1.27 39.62,3.68 39.62,10.21 40.95,11.46 42.52,11.46 42.63,11.57 IC2.10
  Bottom 0.254: v9.53,4.45 6.55,4.45 U$1.5
RESP_DRIVER  (via drill 0.5)
  Top 0.254: R2.2 9.77,8.01 11.56,6.22 11.56,3.05 11.81,2.79 36.32,2.79 37.97,4.45 37.97,10.41 v37.59,10.79 | v42.11,12.32 42.55,12.57 IC2.8
  Bottom 0.254: v37.59,10.79 40.77,10.79 v42.11,12.32
RLD
  Top 0.254: IC5.1 30.06,22.89 R30.1 30.99,22.86 30.99,21.34 R4.2 C2.2 32.04,19.81 C18.1
RLD_OUT  (via drill 0.5)
  Top 0.254: D1.3 34.12,22.86 | D1.3 35.14,22.69 v35.56,23.11 | R30.2 33.87,22.86 D1.3
  Bottom 0.254: v35.56,23.11 37.34,23.11 37.08,22.1 | 37.08,22.1 37.47,22.1 RLD.2 | 37.08,22.1 36.32,21.59 35.56,20.83 35.56,17.02 37.34,15.75 37.72,15.75 RLD.1
SD_CD  (via drill 0.5)
  Top 0.254: 56.13,19.1 R6.2 | 56.13,19.1 58.83,17.02 61.24,16.99 62.08,16.15 64.39,16.15 v64.41,16.13 | IC2.50 51.69,17.12 53.39,18.82 55.7,18.82 56.01,19.1 56.13,19.1
  Bottom 0.254: v64.41,16.13 66.3,16.13 SD.CD1
SD_CLK  (via drill 0.5)
  Top 0.254: IC2.33 54.42,8.57 v56.52,6.48
  Bottom 0.254: SD.5 64.04,4.73 63.88,4.57 58.42,4.57 v56.52,6.48
SD_CS  (via drill 0.5)
  Top 0.254: v53.59,5.11 52.58,5.11 51.14,6.52 IC2.30
  Bottom 0.254: SD.2 60.74,7 60.35,7.39 54.59,7.39 53.98,6.78 53.98,5.49 v53.59,5.11
SD_MISO  (via drill 0.5)
  Top 0.254: IC2.32 52.14,7.53 52.43,7.24 54.28,7.24 v55.04,6.48
  Bottom 0.254: 54.99,6.48 v55.04,6.48 55.37,6.35 57.66,4.06 65.66,4.06 66.29,4.7 66.29,6.01 SD.7
SD_MOSI  (via drill 0.5)
  Top 0.254: v52.81,6.2 52.25,6.2 51.64,6.68 IC2.31
  Bottom 0.254: SD.3 61.75,6.06 61.52,6.3 61.52,7.34 60.94,7.92 54.05,7.92 52.81,6.68 v52.81,6.2
TEMP  (via drill 0.5)
  Top 0.254: R9.1 9.01,9.13 v9.53,9.27 9.53,9.14 12.06,6.6 12.06,3.43 12.19,3.3 35.81,3.3 37.34,4.83 37.34,9.4 v36.83,9.91 | IC2.3 42.97,15.07 42.8,15.24 42.8,16.92 v42.16,17.55
  Bottom 0.254: 8.89,9.02 v9.53,9.27 9.12,8.87 U$1.2 | 37.21,9.78 v36.83,9.91 37.01,9.73 37.59,9.73 38.35,10.34 41.05,10.34 42.16,11.46 42.19,11.46 43.05,11.94 43.05,16.66 v42.16,17.55
USB_POWER
  Top 0.254: C31.1 | USB_CHIP.16 24.74,11.59 25.15,11.18 28.07,11.18 29.08,12.45 29.08,15.37 28.07,16.38 27.15,16.38 26.42,17.12 26.42,17.53 25.76,17.93 23.47,17.93 22.78,18.62 C31.1 | USB_CHIP.1 19.89,16.36 19.63,16.61 19.63,16.92 18.95,17.6 19.41,18.97 22.47,18.97 C31.1
V_CENTRAL  (via drill 0.5)
  Top 0.254: R31.2 R32.2 17.66,17.28 18.03,18.67 18.03,19.56 v18.16,19.68 | v31.37,14.02 31.8,13.97 32.92,13.97 IC4.3
  Bottom 0.254: v31.37,14.02 31.37,17.14 29.59,18.67 28.32,19.81 v18.16,19.68
V_USB  (via drill 0.5)
  Top 0.254: v27.28,12.19 27.02,13.46 C27.1 26.62,13.86 USB_CHIP.19 | v53.19,2.16 53.19,3.03 C30.A
  Top 0.406: CHARGER/MCP7383.4 55.68,5.52 C30.A
  Bottom 0.254: v53.19,2.16 53.19,2.95 50.9,2.95 50.75,3 50.75,3.02 50.42,3.35 40.36,3.33 39.6,3.66 36.22,3.66 27.69,12.19 v27.28,12.19 26.06,13.21 25.15,13.21 22.91,10.97 22.2,10.97 21.08,9.86 21.08,9.22 20.35,8.49 U$6.1
VBATT  (via drill 0.5)
  Top 0.254: U$2.1 67.82,15.44 69.29,15.44 69.62,15.77 v69.85,16.05 | VREG.3 66.87,3.11 C21.A 65.08,5.01 VREG.1 68.44,5.01 69.06,5.64 73.84,5.64 v74.47,5
  Top 0.406: CHARGER/MCP7383.3 61.66,5.52 C24.A C21.A
  Bottom 0.254: v74.47,5 71.96,5.03 71.04,5.94 71.04,13.54 69.83,14.99 69.83,15.75 v69.85,16.05
VCC  (via drill 0.5)
  Top 0.254: 28.84,20.24 IC5.5 27.81,19.78 27.61,19.58 27.61,18.86 C1.1 | C1.1 26.15,18.29 C5.1 R100.2 24.26,19.56 19.05,19.56 18.41,17.78 17.91,16.38 15.62,16.38 15.24,16.76 14.42,16.76 | 14.42,16.76 14.42,17.96 14.11,18.28 C32.1 9.79,18.28 | 14.42,16.76 IC25.7 14.42,15.02 14.66,14.78 14.66,11.66 14.4,11.4 12.19,11.4 12.01,11.58 11.12,12.51 C12.1 11.09,12.55 R25.2 | 9.79,18.28 9.14,18.92 9.14,20.17 D2.2 | U$5.3 72.1,7.11 C22.A 69.7,7.14 68.83,7.14 68.49,7.48 68.49,8.33 | R12.1 R15.1 | HUMIDITY.V+ 4.06,1.78 4.33,1.51 C36.1 5.73,1.52 7.24,1.52 v7.49,1.78 | ISP.2 65.86,22.66 66.93,21.59 68.83,21.59 68.96,21.46 68.96,20.56 D3.2 68.84,20.44 R17.2 68.84,18.05 68.45,17.65 66.8,17.65 65.38,16.23 65.38,11.91 66.37,10.95 67.15,10.95 R16.1 68.37,10.95 R12.1 | 35.33,20.58 D1.2 | 9.79,18.28 9.28,18.28 9.09,18.47 7.85,18.47 4.65,15.27 4.65,12.32 v5.54,11.43 6.03,10.93 R9.2 | C1.1 27.04,17.16 27.3,16.89 28.32,16.89 29.59,15.62 29.59,13.21 30.35,12.45 35.81,12.45 | 35.81,12.45 36.83,13.46 36.83,15.62 | 36.83,15.62 36.45,16 35.66,16 IC4.5 35.06,16.46 C20.1 | C23.A 40.77,16.13 v40.01,16.89 38.73,15.62 36.83,15.62 | v40.62,13.59 44.04,13.59 IC2.6 | v43.05,21.82 43.05,22.55 42.55,23.06 41.08,23.06 MAIN_OSC.4 39.55,21.59 37.01,21.59 36,20.58 35.33,20.58 | v61.42,21.46 61.36,21.52 C29.A 59,22.18 C28.1 R6.1 56.07,22.12 54.94,22.12 54.86,22.05 v54.86,21.36 | R12.1 68.49,11.07 R23.2 68.49,8.33 | v60.6,9.14 60.6,9.17 60.4,9.37 | IC2.35 60.18,9.57 v60.6,9.14 | C11.1 63.18,8.02 62.59,8.61 | 62.59,8.61 61.14,8.61 v60.6,9.14 | 62.59,8.61 63.3,8.61 63.58,8.33 65.51,8.33 65.68,8.51 68.31,8.51 68.49,8.33
  Top 0.254: IC2.45 54.24,14.57 v54.53,14.76 | 45.12,1.19 ACCEL.1 | 45.12,1.19 45.14,1.17 48.97,1.17 49.07,1.27 | 49.07,1.27 49.07,2.46 ACCEL.6 | IC2.25 48.64,7.55 48.84,7.34 49.96,7.34 50.16,7.14 50.16,6.17 51.94,4.39 51.94,1.65 | 45.12,1.19 44.42,1.19 C59.1 | 49.07,1.27 51.69,1.27 51.94,1.52 51.94,1.65 | v40.41,9.09 40.51,9.07 41.72,9.07 C26.1 42,9.07 IC2.15 | v51.44,2.16 51.94,1.65 | 35.81,12.45 35.84,12.42 35.84,10.24 35.31,9.8 34.24,9.8 v27.69,9.83 30.79,6.86 R22.2 | v54.86,21.36 54.79,21.44 | 35.33,20.58 35.27,20.58 | 46.14,19.2 46.14,20.36 v46.63,20.65 | 46.14,19.2 46.11,19.18 46.02,19.18 46.05,19.15 46.05,17.75 46.14,17.31 IC2.61 | 50.14,16.87 50.14,16.84 IC2.53 50.14,18.13 50.24,18.23 C6.A | 46.14,19.2 46.9,19.2 C16.1 | C6.A 50.14,21.34 50.14,22.38 50.49,22.66 54.38,22.66 54.86,22.2 v54.86,21.36 | C6.A 50.22,21.41
  Bottom 0.254: v5.54,11.43 5.66,11.18 U$1.1 4.02,10.37 3.68,10.03 3.68,2.29 4.06,1.91 7.37,1.91 v7.49,1.78 | v40.01,16.89 40.13,16.89 40.58,16.45 | 40.58,16.45 40.64,15.88 v40.62,13.59 | v43.05,21.82 43.94,22.71 54.36,22.71 54.86,22.2 v54.86,21.36 54.86,19.71 56.21,19.71 57.07,18.69 57.07,15.65 56.19,14.76 v54.53,14.76 | v61.42,21.46 63.75,21.46 ISP.2 | SD.4 62.94,6.81 v60.6,9.14 | v43.05,21.82 43.2,21.97 44.48,21.97 45.41,21.03 45.41,20.78 45.54,20.65 v46.63,20.65 47.75,19.18 47.8,12.09 47.17,11.46 44.04,11.46 42.67,10.57 42.62,10.54 41.66,9.58 41.02,9.07 v40.41,9.09 | v51.44,2.16 51.44,1.88 50.83,1.27 36.65,1.27 v27.69,9.83 | v43.05,21.82 43.18,21.59 40.64,19.05 40.64,16.51 40.58,16.45
VDD  (via drill 0.5)
  Top 0.254: VREG.5 71.69,5.01 U$5.2 73.69,3.02 v74.45,3.02 | IC2.51 51.24,17.58 51.71,18.16 v51.77,18.36
  Bottom 0.254: v51.77,18.36 51.74,4.65 52.83,3.43 63.98,3.56 66.34,1.32 72.75,1.32 v74.45,3.02
VREF  (via drill 0.5)
  Top 0.254: C10.1 R101.2 24.26,21.08 | C10.1 26.79,21.58 26.92,21.72 26.92,22.32 IC5.3 | C10.1 C5.2 | 24.26,21.08 R100.1 23.89,20.46 | v9.02,17.53 9.45,17.02 R18.2 C33.2 | v22.99,21.72 23.62,21.72 24.26,21.08
  Bottom 0.254: v9.02,17.53 11.81,20.57 21.84,20.57 v22.99,21.72

### Text on the board
Reference: + | - | + | + | + | ON | Joshua Schapiro | ChestStrap V3 | May 31, 2011